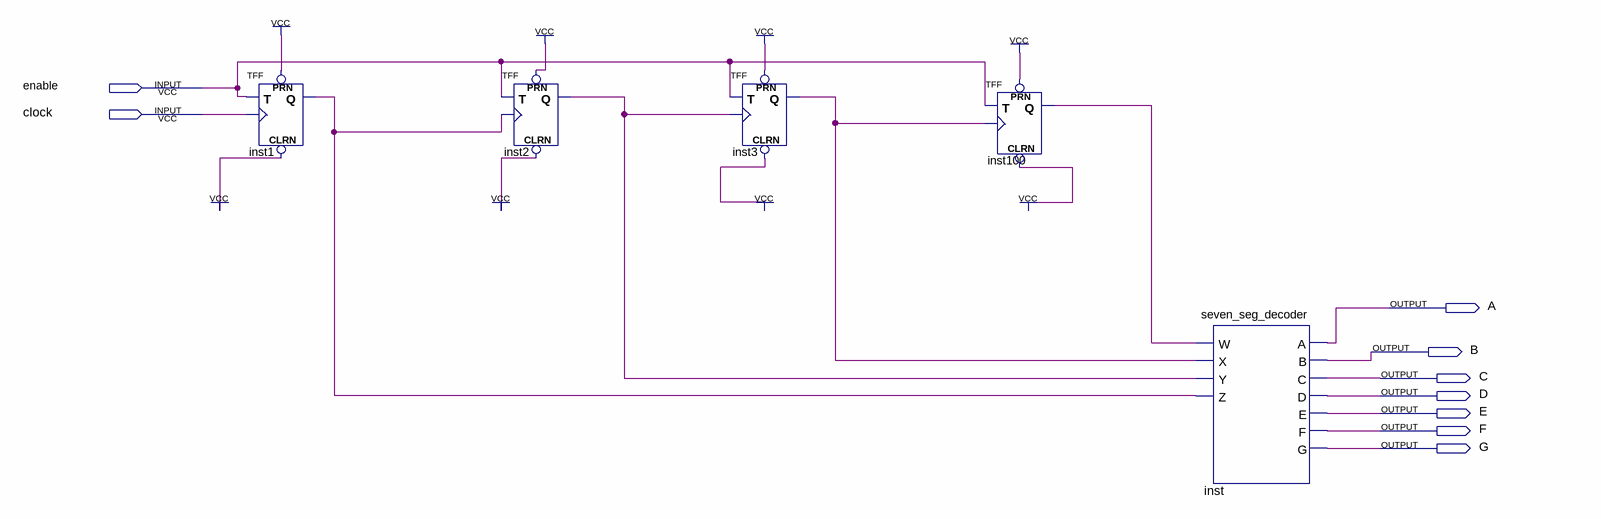
[diagram p0: schematic sheet]
// Quartus schematic labstep3b.bdf as structural Verilog: 5 symbols, 9 pins
module labstep3b (
  input  enable,
  input  clock,
  output A,
  output B,
  output C,
  output D,
  output E,
  output F,
  output G
);

  wire inst1_q, inst2_q, inst3_q, inst100_q;

  TFF inst1 (.PRN(1'b1), .CLRN(1'b1), .T(enable), .CLK(clock), .Q(inst1_q));
  TFF inst2 (.PRN(1'b1), .CLRN(1'b1), .T(enable), .CLK(inst1_q), .Q(inst2_q));
  TFF inst3 (.PRN(1'b1), .CLRN(1'b1), .T(enable), .CLK(inst2_q), .Q(inst3_q));
  TFF inst100 (.PRN(1'b1), .CLRN(1'b1), .T(enable), .CLK(inst3_q), .Q(inst100_q));
  seven_seg_decoder inst (
    .W(inst100_q), .X(inst3_q), .Y(inst2_q), .Z(inst1_q), .A(A), .B(B), .C(C), .D(D), .E(E), .F(F), .G(G));
endmodule
